# Altium schematic sheet main.SchDoc
size A4; SheetNumber: 1; SheetTotal: 1
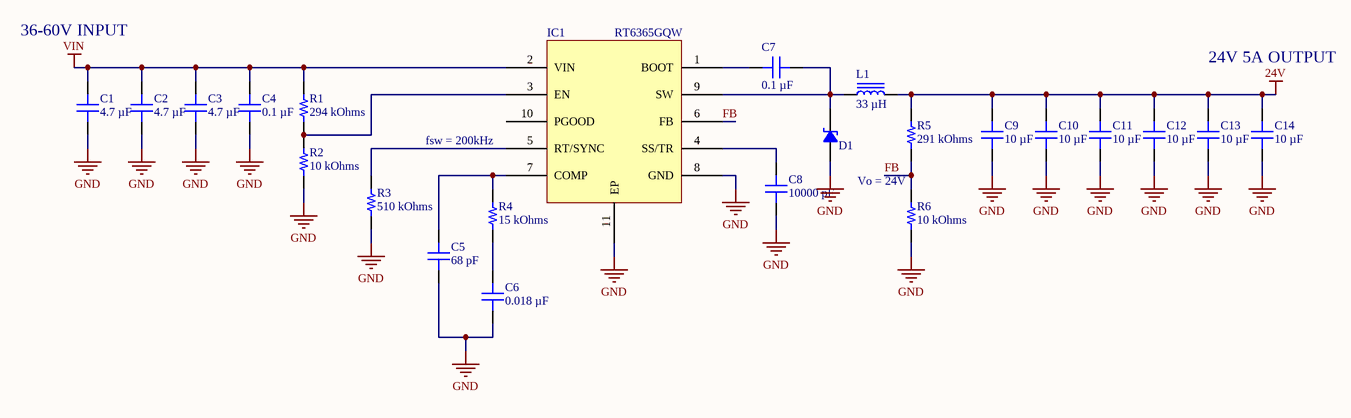
[diagram p0: main.SchDoc]

## Parts
C1  4.7 µF  [CAP 1206_3216 - 0.8MM]
C2  4.7 µF  [CAP 1206_3216 - 0.8MM]
C3  4.7 µF  [CAP 1206_3216 - 0.8MM]
C4  0.1 µF  [CAP 0603_1608]
C5  68 pF  [CAP 0603_1608]
C6  value 0.018 µF  [CAP 0603_1608]  (hidden comment: 18 nF)
C7  0.1 µF  [CAP 0603_1608]
C8  value 10000 pF  [CAP 0603_1608]  (hidden comment: 10 nF)
C9  10 µF  [CAP 1206_3216 - 0.8MM]
C10  10 µF  [CAP 1206_3216 - 0.8MM]
C11  10 µF  [CAP 1206_3216 - 0.8MM]
C12  10 µF  [CAP 1206_3216 - 0.8MM]
C13  10 µF  [CAP 1206_3216 - 0.8MM]
C14  10 µF  [CAP 1206_3216 - 0.8MM]
D1  DIODE SCHOTTKY 60V 10A TO277B  [SVM1060XB_R2_00001]  (value not drawn)
IC1  RT6365GQW  [RT6365GQW]
L1  33 µH  [SRP1265A]
R1  294 kOhms  [RES 0603_1608]
R2  10 kOhms  [RES 0603_1608]
R3  510 kOhms  [RES 0603_1608]
R4  15 kOhms  [RES 0603_1608]
R5  291 kOhms  [RES 0603_1608]
R6  10 kOhms  [RES 0603_1608]

## Nets
24V: C9.2 C10.2 C11.2 C12.2 C13.2 C14.2 L1.2 R5.2
GND: C1.1 C2.1 C3.1 C4.1 C5.1 C6.1 C8.1 C9.1 C10.1 C11.1 C12.1 C13.1 C14.1 D1.1(Anode) IC1.8(GND) IC1.11(EP) R2.1 R3.1 R6.1
VIN: C1.2 C2.2 C3.2 C4.2 IC1.2(VIN) R1.2
FB: IC1.6(FB) R5.1 R6.2
NetC5_2: C5.2 IC1.7(COMP) R4.2
NetC6_2: C6.2 R4.1
NetC7_1: C7.1 D1.2(Cathode) IC1.9(SW) L1.1
NetC7_2: C7.2 IC1.1(BOOT)
NetC8_2: C8.2 IC1.4(SS/TR)
NetIC1_3: IC1.3(EN) R1.1 R2.2
NetIC1_5: IC1.5(RT/SYNC) R3.2

Not connected (* = marked no-connect by the designer): IC1 10(PGOOD)

## Notes on the sheet
- 36-60V INPUT
- 24V 5A OUTPUT
- fsw = 200kHz
- (near R6) Vo = 24V

## Library data of the parts
C1-C3 = GRM31CZ72A475KE11L: CAP CER 4.7UF 100V X7R 1206; manufacturer: Murata Electronics; Tolerance: ±10%; Part Number: GRM31CZ72A475KE11L; Value: 4.7 µF; Applications: General Purpose; Capacitance: 4.7 µF; componentlink1description: Datasheet; componentlink1url: https://search.murata.co.jp/Ceramy/image/img/A01X/G101/ENG/GRM31CZ72A475KE11-01A.pdf; componentlink2description: DigiKey Link; componentlink2url: https://www.digikey.com/en/products/detail/murata-electronics/GRM31CZ72A475KE11L/16033916; Device Package: 1206 (3216 Metric); lastupdated: 26.11.2023 20:17:23; Lifecycle Status: Active; Minimum Order: 1; Mounting Type: Surface Mount, MLCC; Operating Temperature: -55°C ~ 125°C; Package / Case: 1206 (3216 Metric); packaging: TapeAndReel; partid: 45060; Part Status: Active; price: 0.19; series: GRM; Size / Dimension: 0.126" L x 0.063" W (3.20mm x 1.60mm); Supplier 1: DigiKey; Supplier Part Number 1: 490-GRM31CZ72A475KE11LCT-ND; Temperature Coefficient: X7R; Thickness (Max): 0.075" (1.90mm); Voltage - Rated: 100V
C4 C7 = CL10B104KC8NNNC: CAP CER 0.1UF 100V X7R 0603; manufacturer: Samsung Electro-Mechanics; Tolerance: ±10%; Part Number: CL10B104KC8NNNC; Value: 0.1 µF; Applications: General Purpose; Capacitance: 0.1 µF; componentlink1description: Datasheet; componentlink1url: http://www.samsungsem.com/kr/support/product-search/mlcc/CL10B104KC8NNNC.jsp; componentlink2description: DigiKey Link; componentlink2url: https://www.digikey.com/en/products/detail/samsung-electro-mechanics/CL10B104KC8NNNC/5961291; Device Package: 0603 (1608 Metric); lastupdated: 26.11.2023 20:10:18; Lifecycle Status: Active; Minimum Order: 1; Mounting Type: Surface Mount, MLCC; Operating Temperature: -55°C ~ 125°C; Package / Case: 0603 (1608 Metric); packaging: TapeAndReel; partid: 14045; Part Status: Active; price: 0.01; series: CL; Size / Dimension: 0.063" L x 0.031" W (1.60mm x 0.80mm); Supplier 1: DigiKey; Supplier Part Number 1: 1276-6807-1-ND; Temperature Coefficient: X7R; Thickness (Max): 0.035" (0.90mm); Voltage - Rated: 100V
C5 = CL10C680JB8NNNC: CAP CER 68PF 50V C0G/NP0 0603; manufacturer: Samsung Electro-Mechanics; Temperature Coefficient: C0G, NP0; Tolerance: ±5%; Part Number: CL10C680JB8NNNC; Value: 68 pF; Applications: General Purpose; Capacitance: 68 pF; componentlink1description: Datasheet; componentlink1url: http://www.samsungsem.com/kr/support/product-search/mlcc/CL10C680JB8NNNC.jsp; componentlink2description: DigiKey Link; componentlink2url: https://www.digikey.com/en/products/detail/samsung-electro-mechanics/CL10C680JB8NNNC/3886793; Device Package: 0603 (1608 Metric); lastupdated: 26.11.2023 20:10:29; Lifecycle Status: Active; Minimum Order: 1; Mounting Type: Surface Mount, MLCC; Operating Temperature: -55°C ~ 125°C; Package / Case: 0603 (1608 Metric); packaging: TapeAndReel; partid: 38849; Part Status: Active; price: 0.01; series: CL; Size / Dimension: 0.063" L x 0.031" W (1.60mm x 0.80mm); Supplier 1: DigiKey; Supplier Part Number 1: 1276-1135-1-ND; Thickness (Max): 0.035" (0.90mm); Voltage - Rated: 50V
C6 = CC0603JRX7R8BB183: CAP CER 0.018UF 25V X7R 0603; manufacturer: Yageo; Tolerance: ±5%; Part Number: CC0603JRX7R8BB183; Applications: General Purpose; Capacitance: 0.018 µF; componentlink1description: Datasheet; componentlink1url: https://www.yageo.com/upload/media/product/productsearch/datasheet/mlcc/UPY-GPHC_X7R_6.3V-to-250V_23.pdf; componentlink2description: DigiKey Link; componentlink2url: https://www.digikey.com/en/products/detail/yageo/CC0603JRX7R8BB183/5883659; Device Package: 0603 (1608 Metric); lastupdated: 26.11.2023 20:08:52; Lifecycle Status: Active; Minimum Order: 1; Mounting Type: Surface Mount, MLCC; Operating Temperature: -55°C ~ 125°C; Package / Case: 0603 (1608 Metric); packaging: TapeAndReel; partid: 55665; price: 0.01; series: CC; Size / Dimension: 0.063" L x 0.031" W (1.60mm x 0.80mm); Supplier 1: DigiKey; Supplier Part Number 1: 13-CC0603JRX7R8BB183CT-ND; Temperature Coefficient: X7R; Thickness (Max): 0.035" (0.90mm); Voltage - Rated: 25V
C8 = CL10B103KB8NNNC: CAP CER 10000PF 50V X7R 0603; manufacturer: Samsung Electro-Mechanics; Tolerance: ±10%; Part Number: CL10B103KB8NNNC; Applications: General Purpose; Capacitance: 10000 pF; componentlink1description: Datasheet; componentlink1url: http://www.samsungsem.com/kr/support/product-search/mlcc/CL10B103KB8NNNC.jsp; componentlink2description: DigiKey Link; componentlink2url: https://www.digikey.com/en/products/detail/samsung-electro-mechanics/CL10B103KB8NNNC/3886667; Device Package: 0603 (1608 Metric); lastupdated: 26.11.2023 20:10:30; Lifecycle Status: Active; Minimum Order: 1; Mounting Type: Surface Mount, MLCC; Operating Temperature: -55°C ~ 125°C; Package / Case: 0603 (1608 Metric); packaging: TapeAndReel; partid: 5498; Part Status: Active; price: 0.01; series: CL; Size / Dimension: 0.063" L x 0.031" W (1.60mm x 0.80mm); Supplier 1: DigiKey; Supplier Part Number 1: 1276-1009-1-ND; Temperature Coefficient: X7R; Thickness (Max): 0.035" (0.90mm); Voltage - Rated: 50V
C9-C14 = CL31B106KBHNNNE: CAP CER 10UF 50V X7R 1206; manufacturer: Samsung Electro-Mechanics; Tolerance: ±10%; Part Number: CL31B106KBHNNNE; Value: 10 µF; Applications: General Purpose; Capacitance: 10 µF; componentlink1description: Datasheet; componentlink1url: http://www.samsungsem.com/kr/support/product-search/mlcc/CL31B106KBHNNNE.jsp; componentlink2description: DigiKey Link; componentlink2url: https://www.digikey.com/en/products/detail/samsung-electro-mechanics/CL31B106KBHNNNE/5961251; Device Package: 1206 (3216 Metric); lastupdated: 26.11.2023 20:18:07; Lifecycle Status: Active; Minimum Order: 1; Mounting Type: Surface Mount, MLCC; Operating Temperature: -55°C ~ 125°C; Package / Case: 1206 (3216 Metric); packaging: TapeAndReel; partid: 40563; Part Status: Active; price: 0.06; series: CL; Size / Dimension: 0.126" L x 0.063" W (3.20mm x 1.60mm); Supplier 1: DigiKey; Supplier Part Number 1: 1276-6767-1-ND; Temperature Coefficient: X7R; Thickness (Max): 0.071" (1.80mm); Voltage - Rated: 50V
D1 = SVM1060XB_R2_00001: Diode 60 V 10A Surface Mount TO-277B
IC1 = RT6365GQW: IC REG BUCK ADJ 5A 10WDFN
L1 = 7447709330: FIXED IND 33UH 4.2A 45 MOHM SMD; Manufacturer: Würth Elektronik; Current - Saturation: 5.5A; DC Resistance (DCR): 45mOhm Max; Frequency - Self Resonant: 8.5MHz; Inductance Frequency - Test: 1 kHz; Material - Core: Ferrite; Shielding: Shielded; Tolerance: ±20%; Type: Drum Core, Wirewound; Part Number: 7447709330; ComponentLink1Description: Datasheet; ComponentLink1URL: https://katalog.we-online.de/pbs/datasheet/7447709330.pdf; ComponentLink2Description: DigiKey Link; ComponentLink2URL: https://www.digikey.com/en/products/detail/würth-elektronik/7447709330/1638649; Current Rating (Amps): 4.2 A; Device Package: Nonstandard; Height - Seated (Max): 0.394" (10.00mm); Inductance: 33 µH; LastUpdated: 26.11.2023 21:52:22; Lifecycle Status: Active; Minimum Order: 1; Mounting Type: Surface Mount; Operating Temperature: -40°C ~ 125°C; Package / Case: Nonstandard; Packaging: TapeAndReel; PartId: 5692; Part Status: Active; Price: 1.48; Ratings: AEC-Q200; Series: WE-PD; Size / Dimension: 0.472" L x 0.472" W (12.00mm x 12.00mm); Supplier 1: DigiKey; Supplier Part Number 1: 732-1244-1-ND; Supplier Device Package: 1212; Value: 33 µH
R1 = RC0603FR-07294KL: RES 294K OHM 1% 1/10W 0603; Manufacturer: Yageo; Power (Watts): 0.1W, 1/10W; Temperature Coefficient: ±100ppm/°C; Part Number: RC0603FR-07294KL; Value: 294 kOhms; ComponentLink1Description: Datasheet; ComponentLink1URL: https://www.yageo.com/upload/media/product/productsearch/datasheet/rchip/PYu-RC_Group_51_RoHS_L_10.pdf; ComponentLink2Description: DigiKey Link; ComponentLink2URL: https://www.digikey.com/en/products/detail/yageo/RC0603FR-07294KL/727118; Composition: Thick Film; Device Package: 0603 (1608 Metric); Features: Moisture Resistant; Height - Seated (Max): 0.022" (0.55mm); LastUpdated: 26.11.2023 20:38:26; Lifecycle Status: Active; Minimum Order: 1; Number of Terminations: 2; Operating Temperature: -55°C ~ 155°C; Package / Case: 0603 (1608 Metric); Packaging: CutTape; PartId: 22831; Part Status: Active; Price: 0.01; Resistance: 294 kOhms; Series: RC_L; Size / Dimension: 0.063" L x 0.031" W (1.60mm x 0.80mm); Supplier 1: DigiKey; Supplier Part Number 1: 311-294KHRCT-ND; Supplier Device Package: 0603; Tolerance: ±1%
R2 R6 = RC0603FR-0710KL: RES 10K OHM 1% 1/10W 0603; Manufacturer: Yageo; Power (Watts): 0.1W, 1/10W; Temperature Coefficient: ±100ppm/°C; Part Number: RC0603FR-0710KL; Value: 10 kOhms; ComponentLink1Description: Datasheet; ComponentLink1URL: https://www.yageo.com/upload/media/product/productsearch/datasheet/rchip/PYu-RC_Group_51_RoHS_L_10.pdf; ComponentLink2Description: DigiKey Link; ComponentLink2URL: https://www.digikey.com/en/products/detail/yageo/RC0603FR-0710KL/726880; Composition: Thick Film; Device Package: 0603 (1608 Metric); Features: Moisture Resistant; Height - Seated (Max): 0.022" (0.55mm); LastUpdated: 26.11.2023 20:38:27; Lifecycle Status: Active; Minimum Order: 1; Number of Terminations: 2; Operating Temperature: -55°C ~ 155°C; Package / Case: 0603 (1608 Metric); Packaging: CutTape; PartId: 22599; Part Status: Active; Price: 0.01; Resistance: 10 kOhms; Series: RC_L; Size / Dimension: 0.063" L x 0.031" W (1.60mm x 0.80mm); Supplier 1: DigiKey; Supplier Part Number 1: 311-10.0KHRCT-ND; Supplier Device Package: 0603; Tolerance: ±1%
R3 = RC0603FR-07510KL: RES 510K OHM 1% 1/10W 0603; Manufacturer: Yageo; Power (Watts): 0.1W, 1/10W; Temperature Coefficient: ±100ppm/°C; Part Number: RC0603FR-07510KL; Value: 510 kOhms; ComponentLink1Description: Datasheet; ComponentLink1URL: https://www.yageo.com/upload/media/product/productsearch/datasheet/rchip/PYu-RC_Group_51_RoHS_L_10.pdf; ComponentLink2Description: DigiKey Link; ComponentLink2URL: https://www.digikey.com/en/products/detail/yageo/RC0603FR-07510KL/727286; Composition: Thick Film; Device Package: 0603 (1608 Metric); Features: Moisture Resistant; Height - Seated (Max): 0.022" (0.55mm); LastUpdated: 26.11.2023 20:38:54; Lifecycle Status: Active; Minimum Order: 1; Number of Terminations: 2; Operating Temperature: -55°C ~ 155°C; Package / Case: 0603 (1608 Metric); Packaging: CutTape; PartId: 12435; Part Status: Active; Price: 0.01; Resistance: 510 kOhms; Series: RC_L; Size / Dimension: 0.063" L x 0.031" W (1.60mm x 0.80mm); Supplier 1: DigiKey; Supplier Part Number 1: 311-510KHRCT-ND; Supplier Device Package: 0603; Tolerance: ±1%
R4 = AC0603FR-0715KL: RES SMD 15K OHM 1% 1/10W 0603; Manufacturer: Yageo; Power (Watts): 0.1W, 1/10W; Temperature Coefficient: ±100ppm/°C; Part Number: AC0603FR-0715KL; Value: 15 kOhms; ComponentLink1Description: Datasheet; ComponentLink1URL: https://www.yageo.com/upload/media/product/productsearch/datasheet/rchip/PYu-AC_51_RoHS_L_7.pdf; ComponentLink2Description: DigiKey Link; ComponentLink2URL: https://www.digikey.com/en/products/detail/yageo/AC0603FR-0715KL/5895803; Composition: Thick Film; Device Package: 0603 (1608 Metric); Features: Automotive AEC-Q200, Moisture Resistant; Height - Seated (Max): 0.022" (0.55mm); LastUpdated: 26.11.2023 20:38:41; Lifecycle Status: Active; Minimum Order: 1; Number of Terminations: 2; Operating Temperature: -55°C ~ 155°C; Package / Case: 0603 (1608 Metric); Packaging: CutTape; PartId: 17368; Part Status: Active; Price: 0.01; Ratings: AEC-Q200; Resistance: 15 kOhms; Series: AC; Size / Dimension: 0.063" L x 0.031" W (1.60mm x 0.80mm); Supplier 1: DigiKey; Supplier Part Number 1: YAG3569CT-ND; Supplier Device Package: 0603; Tolerance: ±1%
R5 = RN73R1JTTD2913F100: RES 291K OHM 1% 1/10W 0603; Manufacturer: KOA Speer Electronics, Inc.; Power (Watts): 0.1W, 1/10W; Temperature Coefficient: ±100ppm/°C; Part Number: RN73R1JTTD2913F100; Value: 291 kOhms; ComponentLink1Description: Datasheet; ComponentLink1URL: https://media.digikey.com/pdf/Data%20Sheets/KOA%20Speer/RN73R_Type_DS.pdf; ComponentLink2Description: DigiKey Link; ComponentLink2URL: https://www.digikey.com/en/products/detail/koa-speer-electronics-inc/RN73R1JTTD2913F100/10014619; Composition: Thin Film; Device Package: 0603 (1608 Metric); Features: Automotive AEC-Q200, Moisture Resistant; Height - Seated (Max): 0.022" (0.55mm); LastUpdated: 26.11.2023 20:37:21; Lifecycle Status: Active; Minimum Order: 1; Number of Terminations: 2; Operating Temperature: -55°C ~ 155°C; Package / Case: 0603 (1608 Metric); Packaging: TapeAndReel; PartId: 71187; Part Status: Active; Price: 0.04; Ratings: AEC-Q200; Resistance: 291 kOhms; Series: RN73R; Size / Dimension: 0.063" L x 0.031" W (1.60mm x 0.80mm); Supplier 1: DigiKey; Supplier Part Number 1: 2019-RN73R1JTTD2913F100CT-ND; Supplier Device Package: 0603; Tolerance: ±1%